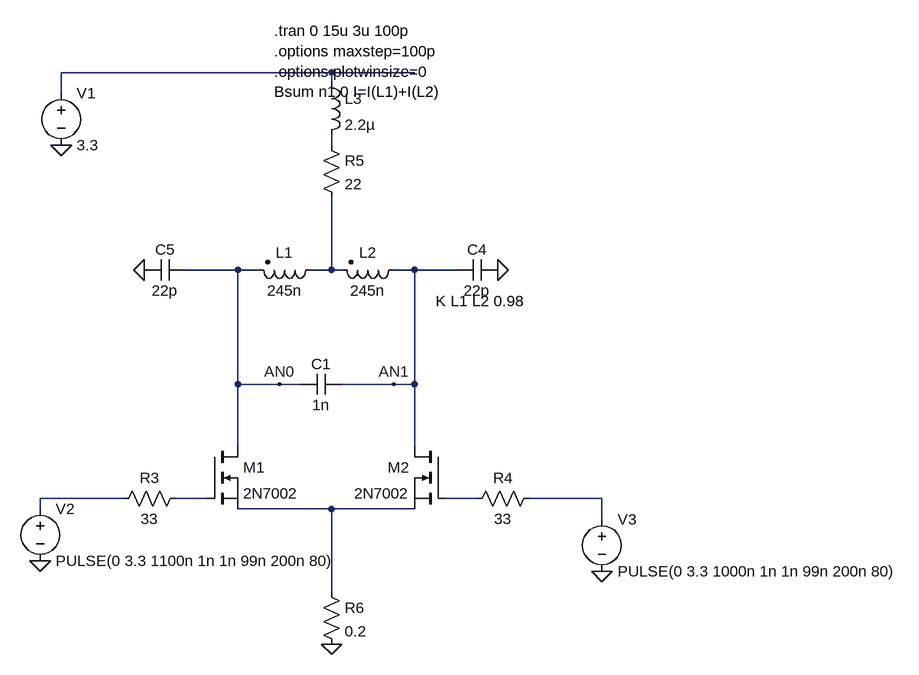
[diagram p0: schematic pushpull.asc]
pushpull.asc, the LTspice schematic file:
Version 4
SHEET 1 1304 752
WIRE 416 -144 0 -144
WIRE 544 -144 416 -144
WIRE 416 -128 416 -144
WIRE 0 -112 0 -144
WIRE 416 -32 416 -48
WIRE 272 160 192 160
WIRE 304 160 272 160
WIRE 416 160 416 48
WIRE 416 160 384 160
WIRE 432 160 416 160
WIRE 544 160 512 160
WIRE 608 160 544 160
WIRE 272 336 272 160
WIRE 336 336 272 336
WIRE 368 336 336 336
WIRE 512 336 432 336
WIRE 544 336 544 160
WIRE 544 336 512 336
WIRE 272 432 272 336
WIRE 544 432 544 336
WIRE 96 512 -32 512
WIRE 224 512 176 512
WIRE 640 512 592 512
WIRE 832 512 720 512
WIRE -32 528 -32 512
WIRE 416 528 272 528
WIRE 544 528 416 528
WIRE 832 544 832 512
WIRE 416 656 416 528
FLAG -32 608 0
FLAG 832 624 0
FLAG 0 -32 0
FLAG 416 736 0
FLAG 336 336 AN0
FLAG 512 336 AN1
FLAG 128 160 0
FLAG 672 160 0
SYMBOL nmos 224 432 R0
SYMATTR InstName M1
SYMATTR Value 2N7002
SYMBOL nmos 592 432 M0
SYMATTR InstName M2
SYMATTR Value 2N7002
SYMBOL ind2 400 144 R90
WINDOW 0 5 56 VBottom 2
WINDOW 3 32 56 VTop 2
SYMATTR InstName L1
SYMATTR Value 245n
SYMATTR Type ind
SYMATTR SpiceLine Rser=0.5
SYMBOL cap 432 320 R90
WINDOW 0 0 32 VBottom 2
WINDOW 3 32 32 VTop 2
SYMATTR InstName C1
SYMATTR Value 1n
SYMBOL voltage 0 -128 R0
SYMATTR InstName V1
SYMATTR Value 3.3
SYMBOL voltage -32 512 R0
SYMATTR InstName V2
SYMATTR Value PULSE(0 3.3 1100n 1n 1n 99n 200n 80)
SYMBOL voltage 832 528 R0
SYMATTR InstName V3
SYMATTR Value PULSE(0 3.3 1000n 1n 1n 99n 200n 80)
SYMBOL res 192 496 R90
WINDOW 0 0 56 VBottom 2
WINDOW 3 32 56 VTop 2
SYMATTR InstName R3
SYMATTR Value 33
SYMBOL res 736 496 R90
WINDOW 0 0 56 VBottom 2
WINDOW 3 32 56 VTop 2
SYMATTR InstName R4
SYMATTR Value 33
SYMBOL ind2 528 144 R90
WINDOW 0 5 56 VBottom 2
WINDOW 3 32 56 VTop 2
SYMATTR InstName L2
SYMATTR Value 245n
SYMATTR Type ind
SYMATTR SpiceLine Rser=0.5
SYMBOL res 400 -48 R0
SYMATTR InstName R5
SYMATTR Value 22
SYMBOL ind 400 -144 R0
SYMATTR InstName L3
SYMATTR Value 2.2µ
SYMBOL res 400 640 R0
SYMATTR InstName R6
SYMATTR Value 0.2
SYMBOL cap 672 144 R90
WINDOW 0 0 32 VBottom 2
WINDOW 3 32 32 VTop 2
SYMATTR InstName C4
SYMATTR Value 22p
SYMBOL cap 192 144 R90
WINDOW 0 0 32 VBottom 2
WINDOW 3 32 32 VTop 2
SYMATTR InstName C5
SYMATTR Value 22p
TEXT 328 -208 Left 2 !.tran 0 15u 3u 100p\n.options maxstep=100p\n.options plotwinsize=0\nBsum n1 0 I=I(L1)+I(L2)
TEXT 576 208 Left 2 !K L1 L2 0.98

The netlist it stands for:
* pushpull.asc
M1 AN0 N005 N008 N008 2N7002
M2 AN1 N006 N008 N008 2N7002
L1 N003 AN0 245n Rser=0.5
C1 AN1 AN0 1n
V1 N001 0 3.3
V2 N004 0 PULSE(0 3.3 1100n 1n 1n 99n 200n 80)
V3 N007 0 PULSE(0 3.3 1000n 1n 1n 99n 200n 80)
R3 N005 N004 33
R4 N007 N006 33
L2 AN1 N003 245n Rser=0.5
R5 N002 N003 22
L3 N001 N002 2.2µ
R6 N008 0 0.2
C4 0 AN1 22p
C5 AN0 0 22p
.model NMOS NMOS
.model PMOS PMOS
.lib standard.mos
.tran 0 15u 3u 100p
.options maxstep=100p
.options plotwinsize=0
Bsum n1 0 I=I(L1)+I(L2)
K L1 L2 0.98
.backanno
.end